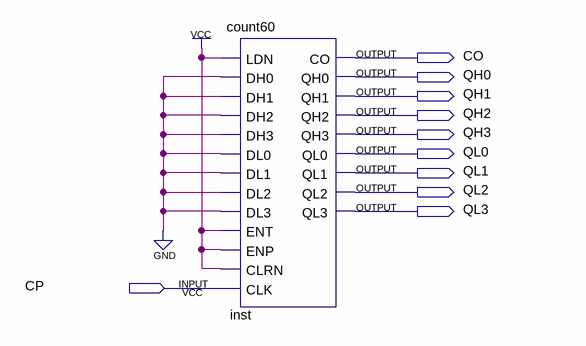
[diagram p0: schematic sheet]
// Quartus schematic lab5.bdf as structural Verilog: 1 symbols, 10 pins
module lab5 (
  input  CP,
  output CO,
  output QH0,
  output QH1,
  output QH2,
  output QH3,
  output QL0,
  output QL1,
  output QL2,
  output QL3
);

  count60 inst (
    .LDN(1'b1), .DH0(1'b0), .DH1(1'b0), .DH2(1'b0), .DH3(1'b0), .DL0(1'b0), .DL1(1'b0), .DL2(1'b0),
    .DL3(1'b0), .ENT(1'b1), .ENP(1'b1), .CLRN(1'b1), .CLK(CP), .CO(CO), .QH0(QH0), .QH1(QH1), .QH2(QH2),
    .QH3(QH3), .QL0(QL0), .QL1(QL1), .QL2(QL2), .QL3(QL3));
endmodule
